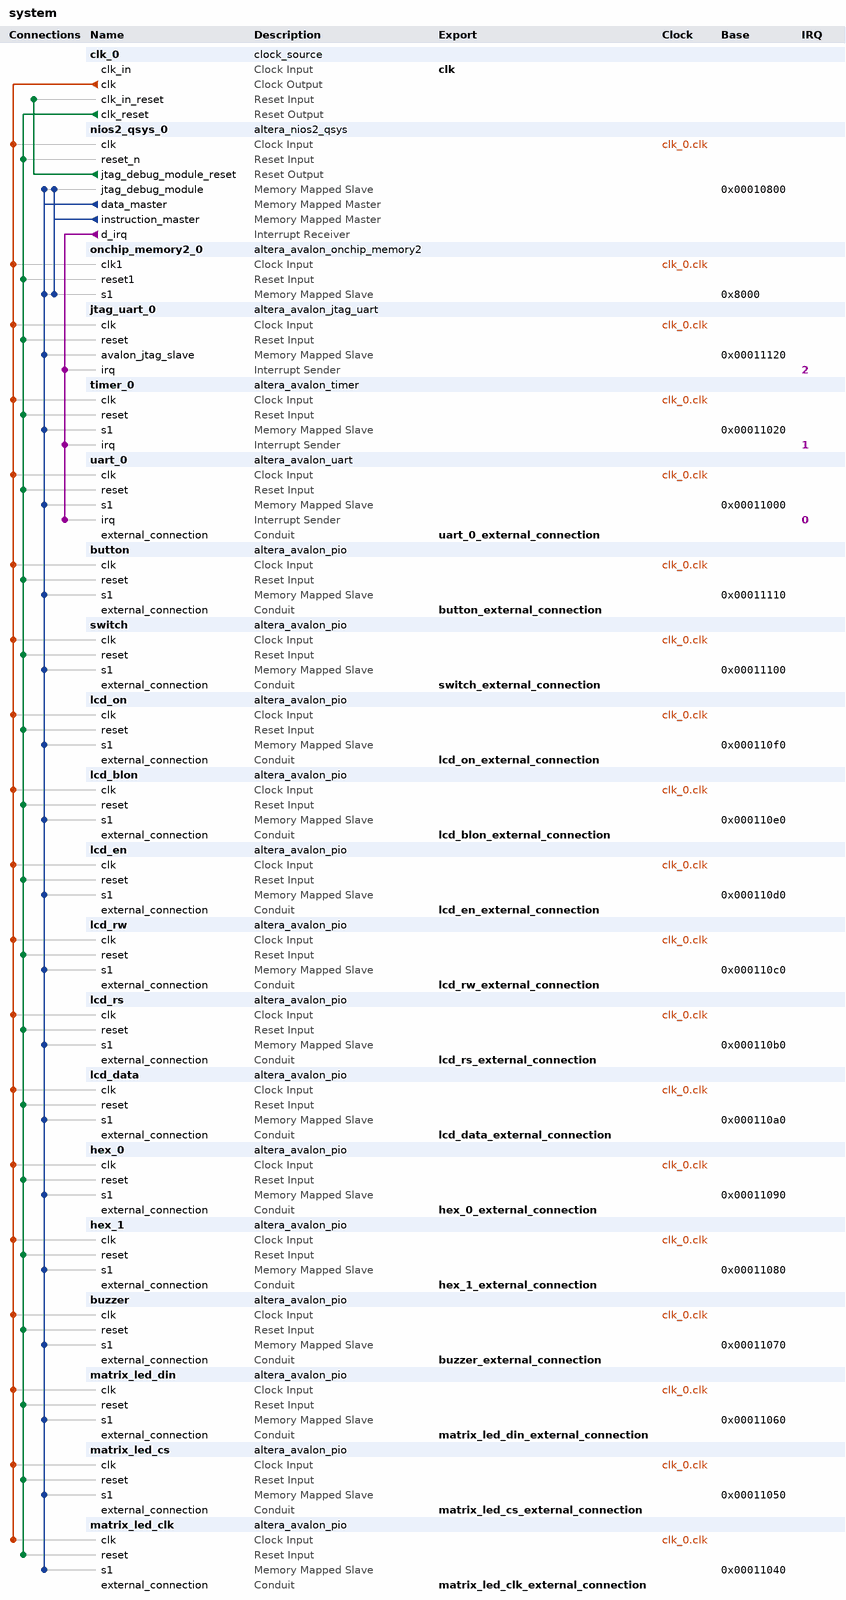
[diagram p0: system contents]
# Platform Designer (Qsys) system system, Cyclone IV E EP4CE115F29C7
# Parameters at their usual value, and those the tool derives, are not listed.
package require -exact qsys 13.0.1.99.2
create_system system
set_project_property DEVICE_FAMILY {Cyclone IV E}
set_project_property DEVICE EP4CE115F29C7

add_instance clk_0 clock_source 13.0
set_instance_parameter_value clk_0 clockFrequency 50000000

add_instance nios2_qsys_0 altera_nios2_qsys 13.0
set_instance_parameter_value nios2_qsys_0 resetSlave onchip_memory2_0.s1
set_instance_parameter_value nios2_qsys_0 mmu_TLBMissExcSlave None
set_instance_parameter_value nios2_qsys_0 exceptionSlave onchip_memory2_0.s1
set_instance_parameter_value nios2_qsys_0 breakSlave nios2_qsys_0.jtag_debug_module
set_instance_parameter_value nios2_qsys_0 impl Tiny
set_instance_parameter_value nios2_qsys_0 icache_size 4096

add_instance onchip_memory2_0 altera_avalon_onchip_memory2 13.0.1.99.2
set_instance_parameter_value onchip_memory2_0 dataWidth 32
set_instance_parameter_value onchip_memory2_0 dualPort false
set_instance_parameter_value onchip_memory2_0 initMemContent true
set_instance_parameter_value onchip_memory2_0 initializationFileName onchip_mem.hex
set_instance_parameter_value onchip_memory2_0 memorySize 32768

add_instance jtag_uart_0 altera_avalon_jtag_uart 13.0.1.99.2
set_instance_parameter_value jtag_uart_0 simInteractiveOptions NO_INTERACTIVE_WINDOWS

add_instance timer_0 altera_avalon_timer 13.0.1.99.2
set_instance_parameter_value timer_0 period 1
set_instance_parameter_value timer_0 periodUnits MSEC

add_instance uart_0 altera_avalon_uart 13.0.1.99.2
set_instance_parameter_value uart_0 baud 9600
set_instance_parameter_value uart_0 dataBits 8
set_instance_parameter_value uart_0 fixedBaud true
set_instance_parameter_value uart_0 parity NONE
set_instance_parameter_value uart_0 stopBits 1

add_instance button altera_avalon_pio 13.0.1.99.2
set_instance_parameter_value button direction Input
set_instance_parameter_value button width 32

add_instance switch altera_avalon_pio 13.0.1.99.2
set_instance_parameter_value switch direction Input
set_instance_parameter_value switch width 32

add_instance lcd_on altera_avalon_pio 13.0.1.99.2
set_instance_parameter_value lcd_on direction Output
set_instance_parameter_value lcd_on width 32

add_instance lcd_blon altera_avalon_pio 13.0.1.99.2
set_instance_parameter_value lcd_blon direction Output
set_instance_parameter_value lcd_blon width 32

add_instance lcd_en altera_avalon_pio 13.0.1.99.2
set_instance_parameter_value lcd_en direction Output
set_instance_parameter_value lcd_en width 32

add_instance lcd_rw altera_avalon_pio 13.0.1.99.2
set_instance_parameter_value lcd_rw direction Output
set_instance_parameter_value lcd_rw width 32

add_instance lcd_rs altera_avalon_pio 13.0.1.99.2
set_instance_parameter_value lcd_rs direction Output
set_instance_parameter_value lcd_rs width 32

add_instance lcd_data altera_avalon_pio 13.0.1.99.2
set_instance_parameter_value lcd_data direction Output
set_instance_parameter_value lcd_data width 32

add_instance hex_0 altera_avalon_pio 13.0.1.99.2
set_instance_parameter_value hex_0 direction Output
set_instance_parameter_value hex_0 width 32

add_instance hex_1 altera_avalon_pio 13.0.1.99.2
set_instance_parameter_value hex_1 direction Output
set_instance_parameter_value hex_1 width 32

add_instance buzzer altera_avalon_pio 13.0.1.99.2
set_instance_parameter_value buzzer direction Output
set_instance_parameter_value buzzer width 32

add_instance matrix_led_din altera_avalon_pio 13.0.1.99.2
set_instance_parameter_value matrix_led_din direction Output
set_instance_parameter_value matrix_led_din width 32

add_instance matrix_led_cs altera_avalon_pio 13.0.1.99.2
set_instance_parameter_value matrix_led_cs direction Output
set_instance_parameter_value matrix_led_cs width 32

add_instance matrix_led_clk altera_avalon_pio 13.0.1.99.2
set_instance_parameter_value matrix_led_clk direction Output
set_instance_parameter_value matrix_led_clk width 32

# connections
add_connection clk_0.clk button.clk clock
add_connection clk_0.clk buzzer.clk clock
add_connection clk_0.clk hex_0.clk clock
add_connection clk_0.clk hex_1.clk clock
add_connection clk_0.clk jtag_uart_0.clk clock
add_connection clk_0.clk lcd_blon.clk clock
add_connection clk_0.clk lcd_data.clk clock
add_connection clk_0.clk lcd_en.clk clock
add_connection clk_0.clk lcd_on.clk clock
add_connection clk_0.clk lcd_rs.clk clock
add_connection clk_0.clk lcd_rw.clk clock
add_connection clk_0.clk matrix_led_clk.clk clock
add_connection clk_0.clk matrix_led_cs.clk clock
add_connection clk_0.clk matrix_led_din.clk clock
add_connection clk_0.clk nios2_qsys_0.clk clock
add_connection clk_0.clk onchip_memory2_0.clk1 clock
add_connection clk_0.clk switch.clk clock
add_connection clk_0.clk timer_0.clk clock
add_connection clk_0.clk uart_0.clk clock
add_connection clk_0.clk_reset button.reset reset
add_connection clk_0.clk_reset buzzer.reset reset
add_connection clk_0.clk_reset hex_0.reset reset
add_connection clk_0.clk_reset hex_1.reset reset
add_connection clk_0.clk_reset jtag_uart_0.reset reset
add_connection clk_0.clk_reset lcd_blon.reset reset
add_connection clk_0.clk_reset lcd_data.reset reset
add_connection clk_0.clk_reset lcd_en.reset reset
add_connection clk_0.clk_reset lcd_on.reset reset
add_connection clk_0.clk_reset lcd_rs.reset reset
add_connection clk_0.clk_reset lcd_rw.reset reset
add_connection clk_0.clk_reset matrix_led_clk.reset reset
add_connection clk_0.clk_reset matrix_led_cs.reset reset
add_connection clk_0.clk_reset matrix_led_din.reset reset
add_connection clk_0.clk_reset nios2_qsys_0.reset_n reset
add_connection clk_0.clk_reset onchip_memory2_0.reset1 reset
add_connection clk_0.clk_reset switch.reset reset
add_connection clk_0.clk_reset timer_0.reset reset
add_connection clk_0.clk_reset uart_0.reset reset
add_connection nios2_qsys_0.jtag_debug_module_reset clk_0.clk_in_reset reset
add_connection nios2_qsys_0.data_master button.s1 avalon
set_connection_parameter_value nios2_qsys_0.data_master/button.s1 baseAddress 0x00011110
add_connection nios2_qsys_0.data_master buzzer.s1 avalon
set_connection_parameter_value nios2_qsys_0.data_master/buzzer.s1 baseAddress 0x00011070
add_connection nios2_qsys_0.data_master hex_0.s1 avalon
set_connection_parameter_value nios2_qsys_0.data_master/hex_0.s1 baseAddress 0x00011090
add_connection nios2_qsys_0.data_master hex_1.s1 avalon
set_connection_parameter_value nios2_qsys_0.data_master/hex_1.s1 baseAddress 0x00011080
add_connection nios2_qsys_0.data_master jtag_uart_0.avalon_jtag_slave avalon
set_connection_parameter_value nios2_qsys_0.data_master/jtag_uart_0.avalon_jtag_slave baseAddress 0x00011120
add_connection nios2_qsys_0.data_master lcd_blon.s1 avalon
set_connection_parameter_value nios2_qsys_0.data_master/lcd_blon.s1 baseAddress 0x000110e0
add_connection nios2_qsys_0.data_master lcd_data.s1 avalon
set_connection_parameter_value nios2_qsys_0.data_master/lcd_data.s1 baseAddress 0x000110a0
add_connection nios2_qsys_0.data_master lcd_en.s1 avalon
set_connection_parameter_value nios2_qsys_0.data_master/lcd_en.s1 baseAddress 0x000110d0
add_connection nios2_qsys_0.data_master lcd_on.s1 avalon
set_connection_parameter_value nios2_qsys_0.data_master/lcd_on.s1 baseAddress 0x000110f0
add_connection nios2_qsys_0.data_master lcd_rs.s1 avalon
set_connection_parameter_value nios2_qsys_0.data_master/lcd_rs.s1 baseAddress 0x000110b0
add_connection nios2_qsys_0.data_master lcd_rw.s1 avalon
set_connection_parameter_value nios2_qsys_0.data_master/lcd_rw.s1 baseAddress 0x000110c0
add_connection nios2_qsys_0.data_master matrix_led_clk.s1 avalon
set_connection_parameter_value nios2_qsys_0.data_master/matrix_led_clk.s1 baseAddress 0x00011040
add_connection nios2_qsys_0.data_master matrix_led_cs.s1 avalon
set_connection_parameter_value nios2_qsys_0.data_master/matrix_led_cs.s1 baseAddress 0x00011050
add_connection nios2_qsys_0.data_master matrix_led_din.s1 avalon
set_connection_parameter_value nios2_qsys_0.data_master/matrix_led_din.s1 baseAddress 0x00011060
add_connection nios2_qsys_0.data_master nios2_qsys_0.jtag_debug_module avalon
set_connection_parameter_value nios2_qsys_0.data_master/nios2_qsys_0.jtag_debug_module baseAddress 0x00010800
add_connection nios2_qsys_0.data_master onchip_memory2_0.s1 avalon
set_connection_parameter_value nios2_qsys_0.data_master/onchip_memory2_0.s1 baseAddress 0x8000
add_connection nios2_qsys_0.data_master switch.s1 avalon
set_connection_parameter_value nios2_qsys_0.data_master/switch.s1 baseAddress 0x00011100
add_connection nios2_qsys_0.data_master timer_0.s1 avalon
set_connection_parameter_value nios2_qsys_0.data_master/timer_0.s1 baseAddress 0x00011020
add_connection nios2_qsys_0.data_master uart_0.s1 avalon
set_connection_parameter_value nios2_qsys_0.data_master/uart_0.s1 baseAddress 0x00011000
add_connection nios2_qsys_0.instruction_master nios2_qsys_0.jtag_debug_module avalon
set_connection_parameter_value nios2_qsys_0.instruction_master/nios2_qsys_0.jtag_debug_module baseAddress 0x00010800
add_connection nios2_qsys_0.instruction_master onchip_memory2_0.s1 avalon
set_connection_parameter_value nios2_qsys_0.instruction_master/onchip_memory2_0.s1 baseAddress 0x8000
add_connection nios2_qsys_0.d_irq jtag_uart_0.irq interrupt
set_connection_parameter_value nios2_qsys_0.d_irq/jtag_uart_0.irq irqNumber 2
add_connection nios2_qsys_0.d_irq timer_0.irq interrupt
set_connection_parameter_value nios2_qsys_0.d_irq/timer_0.irq irqNumber 1
add_connection nios2_qsys_0.d_irq uart_0.irq interrupt
set_connection_parameter_value nios2_qsys_0.d_irq/uart_0.irq irqNumber 0

# exported interfaces
add_interface clk clock sink
set_interface_property clk EXPORT_OF clk_0.clk_in
add_interface uart_0_external_connection conduit end
set_interface_property uart_0_external_connection EXPORT_OF uart_0.external_connection
add_interface button_external_connection conduit end
set_interface_property button_external_connection EXPORT_OF button.external_connection
add_interface switch_external_connection conduit end
set_interface_property switch_external_connection EXPORT_OF switch.external_connection
add_interface lcd_on_external_connection conduit end
set_interface_property lcd_on_external_connection EXPORT_OF lcd_on.external_connection
add_interface lcd_blon_external_connection conduit end
set_interface_property lcd_blon_external_connection EXPORT_OF lcd_blon.external_connection
add_interface lcd_en_external_connection conduit end
set_interface_property lcd_en_external_connection EXPORT_OF lcd_en.external_connection
add_interface lcd_rw_external_connection conduit end
set_interface_property lcd_rw_external_connection EXPORT_OF lcd_rw.external_connection
add_interface lcd_rs_external_connection conduit end
set_interface_property lcd_rs_external_connection EXPORT_OF lcd_rs.external_connection
add_interface lcd_data_external_connection conduit end
set_interface_property lcd_data_external_connection EXPORT_OF lcd_data.external_connection
add_interface hex_0_external_connection conduit end
set_interface_property hex_0_external_connection EXPORT_OF hex_0.external_connection
add_interface hex_1_external_connection conduit end
set_interface_property hex_1_external_connection EXPORT_OF hex_1.external_connection
add_interface buzzer_external_connection conduit end
set_interface_property buzzer_external_connection EXPORT_OF buzzer.external_connection
add_interface matrix_led_din_external_connection conduit end
set_interface_property matrix_led_din_external_connection EXPORT_OF matrix_led_din.external_connection
add_interface matrix_led_cs_external_connection conduit end
set_interface_property matrix_led_cs_external_connection EXPORT_OF matrix_led_cs.external_connection
add_interface matrix_led_clk_external_connection conduit end
set_interface_property matrix_led_clk_external_connection EXPORT_OF matrix_led_clk.external_connection

set_interconnect_requirement {$system} qsys_mm.clockCrossingAdapter HANDSHAKE
set_interconnect_requirement {$system} qsys_mm.maxAdditionalLatency 1

save_system system.qsys
